# EAGLE design pressure_temp (EAGLE 9.6.2)
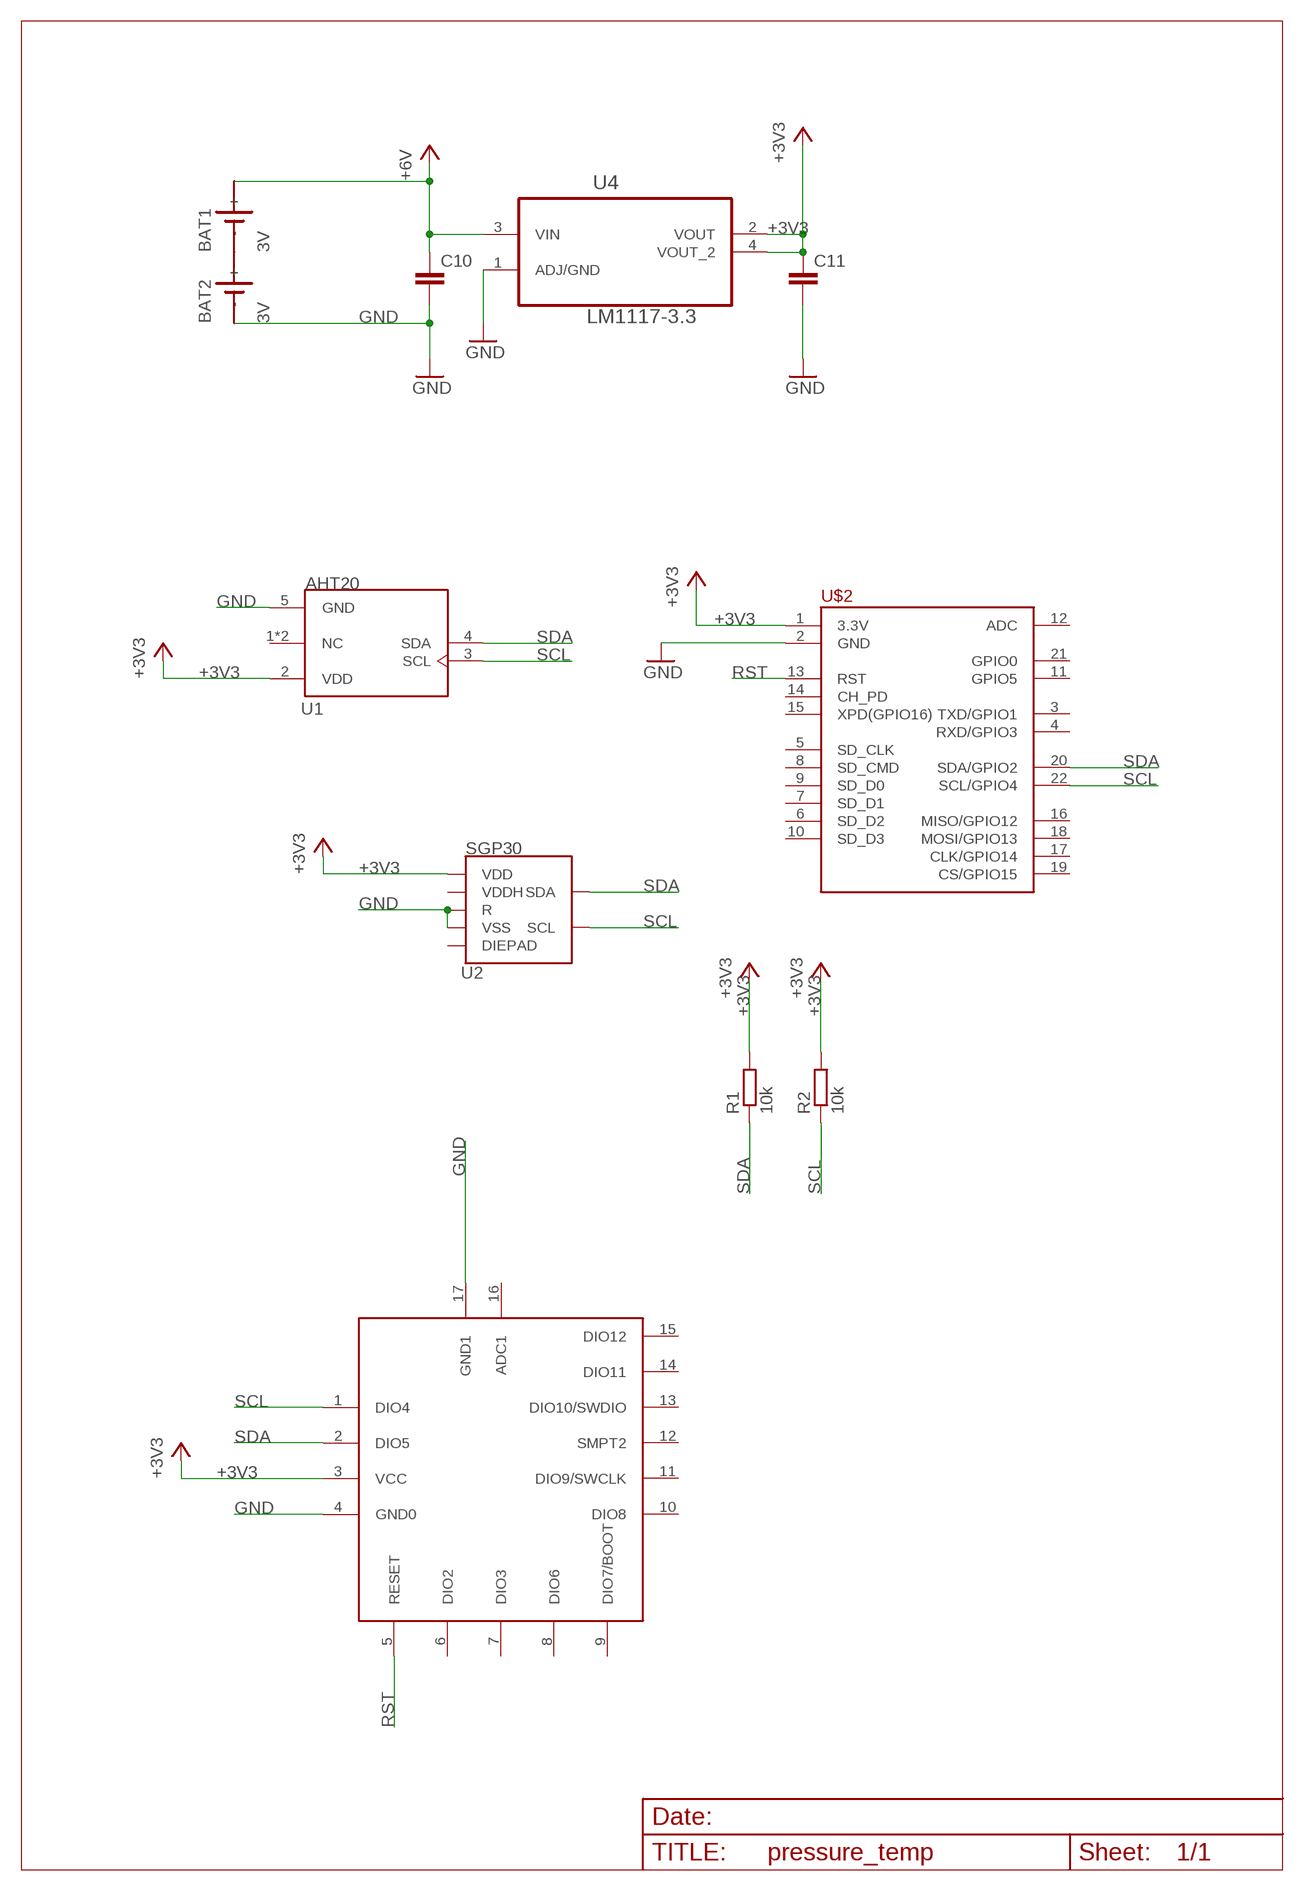
[diagram p0: schematic, sheet 1]

## Parts
BAT1  3V  SN2032  [SN2032]
BAT2  3V  SN2032  [SN2032]
C10  47u  C-EUC1206  [C1206]
C11  10u  C-EUC1206  [C1206]
R1  10k  R-EU_R0402  [R0402]
R2  10k  R-EU_R0402  [R0402]
U1  AHT20  [PSON100P300X300X110-6N]
U2  SGP30  [SGP30]
U4  LM1117-3.3  [SOT230]
U$1  BLUENRG-234BLEMODULE  [BLUENRG-234BLEMODULE]
U$2  OLIMEX_MOD-WIFI-ESP8266-DEV>PINS-OUTSIDE  [OLIMEX_MOD-WIFI-ESP8266-DEV-PINS-OUTSIDE]

## Nets
+3V3 [supply]: C11.1 R1.2 R2.2 U1.2(VDD) U2.1(VDD) U4.2(VOUT) U4.4(VOUT_2) U$1.3(VCC) U$2.1(3.3V)
+6V [supply]: BAT1.+ C10.1 U4.3(VIN)
GND: BAT2.- C10.2 C11.2 U1.5(GND) U2.2(VSS) U2.4(R) U4.1(ADJ/GND) U$1.4(GND0) U$1.17(GND1) U$2.2(GND)
N$1: BAT1.- BAT2.+
RST: U$1.5(RESET) U$2.13(RST)
SCL: R2.1 U1.3(SCL) U2.6(SCL) U$1.1(DIO4) U$2.22(SCL/GPIO4)
SDA: R1.1 U1.4(SDA) U2.3(SDA) U$1.2(DIO5) U$2.20(SDA/GPIO2)
Unconnected: U1.1(NC) U1.6(NC) U2.5(VDDH) U2.DIEPAD U$1.6(DIO2) U$1.7(DIO3) U$1.8(DIO6) U$1.9(DIO7/BOOT) U$1.10(DIO8) U$1.11(DIO9/SWCLK) U$1.12(SMPT2) U$1.13(DIO10/SWDIO) U$1.14(DIO11) U$1.15(DIO12) U$1.16(ADC1) U$2.3(TXD/GPIO1) U$2.4(RXD/GPIO3) U$2.5(SD_CLK) U$2.6(SD_D2) U$2.7(SD_D1) U$2.8(SD_CMD) U$2.9(SD_D0) U$2.10(SD_D3) U$2.11(GPIO5) U$2.12(ADC) U$2.14(CH_PD) U$2.15(XPD(GPIO16)) U$2.16(MISO/GPIO12) U$2.17(CLK/GPIO14) U$2.18(MOSI/GPIO13) U$2.19(CS/GPIO15) U$2.21(GPIO0)

## Library data of the parts
BAT1 BAT2 = sn2032:SN2032: LI BATTERY
C10 C11 = rcl:C-EU: CAPACITOR, European symbol; SPICEPREFIX: C
R1 R2 = rcl:R-EU_: RESISTOR, European symbol; SPICEPREFIX: R
U1 = AHT20:AHT20: Temperature and Humidity sensor Check availability <https://pricing.snapeda.com/parts/AHT20/Asair/view-part?ref=eda>; AVAILABILITY: Not in stock; DESCRIPTION: Temperature and Humidity sensor; MF: Asair; MP: AHT20; PACKAGE: Package; PRICE: None
U2 = SGP30:SGP30: The SGP30 is a digital multi-pixel gas sensor designed for easy integration into air purifier, demand-controlled ventilation, and IoT applications. Check availability <https://pricing.snapeda.com/parts/SGP30/Sensirion%20AG/view-part?ref=eda>; AVAILABILITY: In Stock; DESCRIPTION: SGP30, SHTC1 Air Quality, Humidity, Temperature Sensor Arduino Platform Evaluation Expansion Board; MF: Sensirion AG; MP: SGP30; PACKAGE: None; PRICE: None
U4 = LM1117-3.3:LM1117-3.3: IC REG LDO 800MA 3.3V Check prices <https://pricing.snapeda.com/parts/LM1117-3.3/Texas%20Instruments/view-part?ref=eda>; AVAILABILITY: In Stock; DESCRIPTION: Linear Voltage Regulator IC Positive Fixed 1 Output 800mA DDPAK/TO-263-3; MF: Texas Instruments; MP: LM1117-3.3; PACKAGE: None; PRICE: None
U$1 = BLUENRG-234blemodule:BLUENRG-234BLEMODULE: BLUENRG-234 BLE Module
U$2 = esp8266modules:OLIMEX_MOD-WIFI-ESP8266-DEV: Olimex MOD-WIFI-ESP8266-DEV is an development board for ESP8266 with all GPIOs and resources exposed. It can be soldered to PCB or used with breadboard. Small U.FL connector is provided for external antenna connection.

## Net classes
0 default: width 0.254 mm, clearance 0.203 mm
1 supply: width 0.406 mm, clearance 0.203 mm

## Board
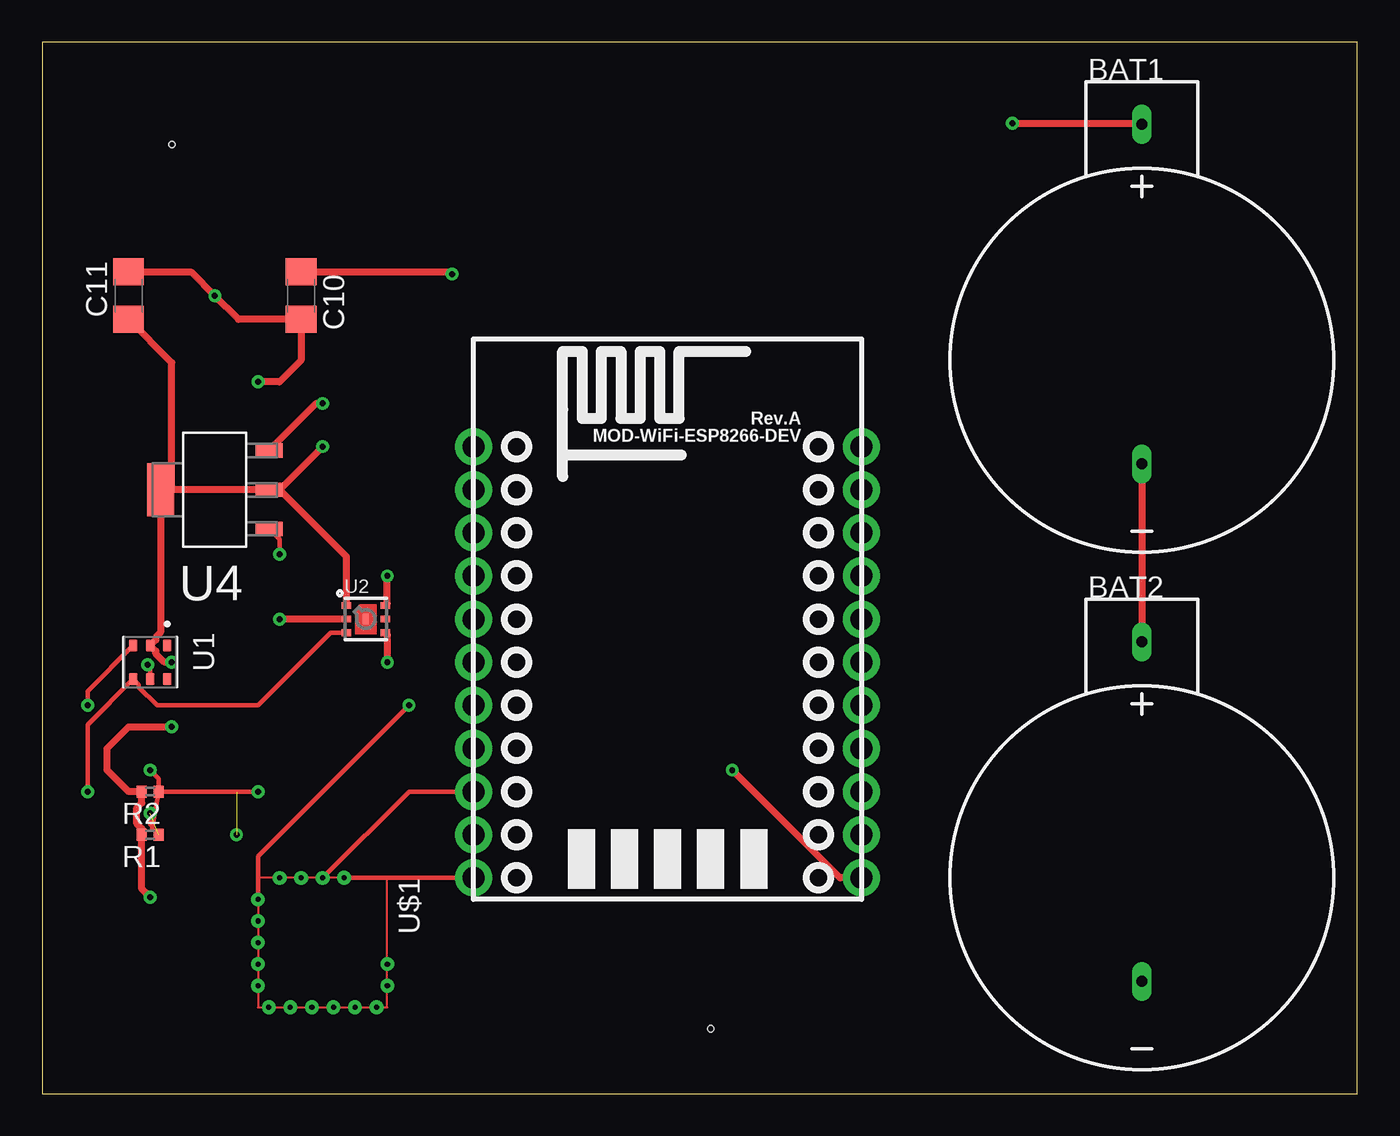
[diagram p1: board, top side]
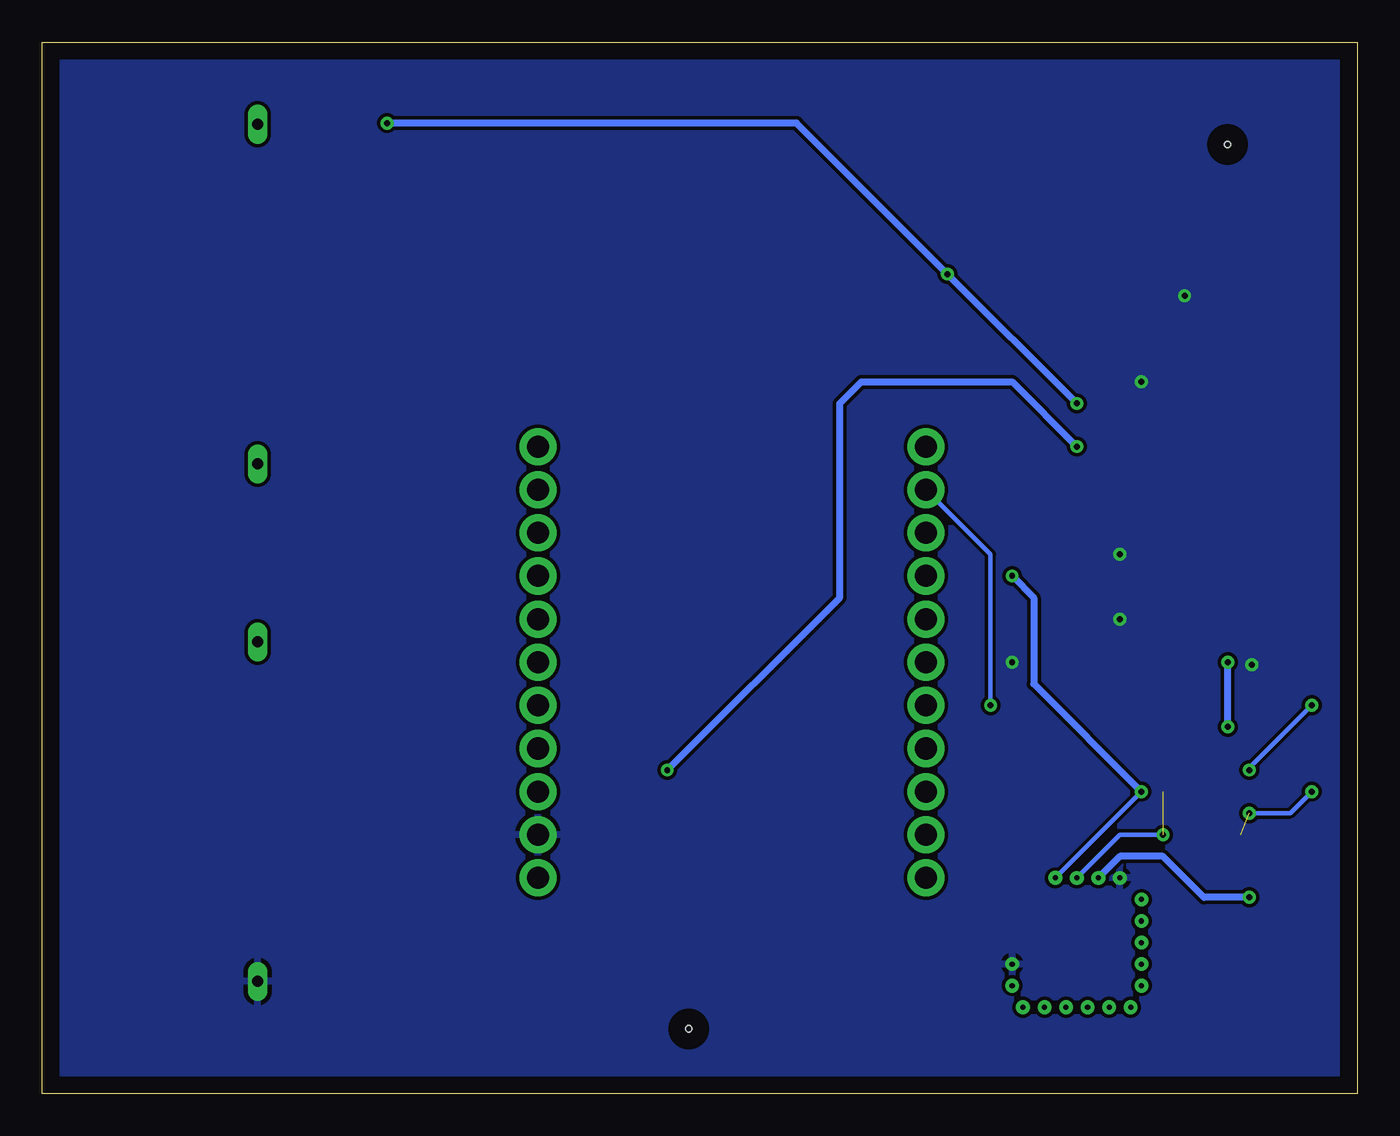
[diagram p2: board, bottom side, seen from below]

Size 77.45 x 61.9 mm. Coordinates in mm from the lower left corner, seen from the top.
Outline: 0,0 77.45,0 77.45,61.9 0,61.9 0,0
Copper layers (1*16): Top 0.035mm / dielectric 1.5mm / Bottom 0.035mm
Design rules "default": minimum track width 6mil, minimum drill 0.35mm, track to track 6mil, track to pad 6mil, pad to pad 6mil, via to via 6mil, smd to smd 6mil, copper to edge 40mil, drill to drill 6mil, minimum pad ring 10mil, minimum via ring 8mil, stop-mask expansion 4mil, vias tented up to drill 0mil, thermal gap 10mil
Holes 0.35 mm at 39.37,3.81 7.62,55.88

### Footprints (pad centres in the part's own frame; a part is rotated, then mirrored left to right if it is on the bottom)
SN2032 = drill 0.65 long: + 0,13.9; - 0,-6.1
C1206 = smd 1.6 x 1.8: 1 -1.4,0; 2 1.4,0
R0402 = smd 0.6 x 0.7: 1 -0.5,0; 2 0.5,0
PSON100P300X300X110-6N = smd 0.71 x 0.53: 1 -0.985,1; 2 -0.985,0; 3 -0.985,-1; 4 0.985,-1; 5 0.985,0; 6 0.985,1
SGP30 = smd 0.55 x 0.4: 1 -1.15,0.8; 2 -1.15,0; 3 -1.15,-0.8; 4 1.15,-0.8; 5 1.15,0; 6 1.15,0.8 | smd 0.305 x 0.61: DIEPAD 0,0
SOT230 = smd 1.6 x 0.838: 1 -3.2,2.311; 2 -3.2,0; 3 -3.2,-2.311 | smd 1.6 x 3.099: 4 3.2,0
BLUENRG-234BLEMODULE = drill 0.3 pad 0.813: 1 -3.81,1.27 | drill 0.3: 2 -3.81,0; 3 -3.81,-1.27; 4 -3.81,-2.54; 5 -2.54,-3.81; 6 -1.27,-3.81; 7 0,-3.81; 8 1.27,-3.81; 9 2.54,-3.81; 10 3.81,-3.175; 11 3.81,-1.905; 12 3.81,-0.635; 13 3.81,0.635; 14 3.81,1.905; 15 3.81,3.175; 16 2.54,3.81; 17 1.27,3.81
OLIMEX_MOD-WIFI-ESP8266-DEV-PINS-OUTSIDE = drill 1.3 pad 2.184: 1 0,0; 2 0,-2.54; 3 0,-5.08; 4 0,-7.62; 5 0,-10.16; 6 0,-12.7; 7 0,-15.24; 8 0,-17.78; 9 0,-20.32; 10 0,-22.86; 11 0,-25.4; 12 22.86,-25.4; 13 22.86,-22.86; 14 22.86,-20.32; 15 22.86,-17.78; 16 22.86,-15.24; 17 22.86,-12.7; 18 22.86,-10.16; 19 22.86,-7.62; 20 22.86,-5.08; 21 22.86,-2.54; 22 22.86,0

### Placement (x,y rotation side)
BAT1  64.77,43.18 0 top
BAT2  64.77,12.7 0 top
C10  15.24,46.99 270 top
C11  5.08,46.99 90 top
R1  6.35,15.24 180 top
R2  6.35,17.78 180 top
U1  6.35,25.4 270 top
U2  19.05,27.94 0 top
U4  10.16,35.56 180 top
U$1  16.51,8.89 270 top
U$2  48.26,12.7 180 top

### Tracks (layer width: path | path; a pad name or v marks a point on that pad's centre or on a via)
+3V3  (via drill 0.35)
  Top 0.406: 7.62,35.56 7.62,43.05 C11.1 | 7.62,35.56 U4.2 13.97,35.56 | U$2.1 46.99,12.7 v40.64,19.05 | U2.1 17.9,31.63 13.97,35.56 | v6.35,11.55 5.85,12.05 R1.2 5.85,15.6 5.57,15.89 5.57,16.84 5.85,17.12 R2.2 5.08,17.78 3.81,19.05 3.81,20.32 5.08,21.59 v7.62,21.59 | v7.62,25.4 7.18,25.4 6.68,25.9 6.68,26.06 U1.2 6.68,26.71 6.68,26.87 6.96,27.15 U4.4 7.62,35.56 | v16.51,38.1 13.97,35.56
  Bottom 0.406: v40.64,19.05 30.48,29.21 30.48,40.64 29.21,41.91 20.32,41.91 v16.51,38.1 | v6.35,11.55 9.01,11.55 11.43,13.97 13.97,13.97 U$1.3 | v7.62,21.59 v7.62,25.4
+6V  (via drill 0.35)
  Top 0.406: U4.3 16.13,40.64 v16.51,40.64 | v57.15,57.15 64.7,57.15 BAT1.+ | C10.1 24,48.39 v24.13,48.26
  Bottom 0.406: v16.51,40.64 v24.13,48.26 33.02,57.15 v57.15,57.15
GND  (via drill 0.35)
  Top 0.254: U1.5 6.35,25.12 v6.21,25.26 | U4.1 13.97,32.64 v13.97,31.75
  Top 0.406: U2.2 v13.97,27.94 | C11.2 8.76,48.39 v10.16,46.99 11.56,45.59 C10.2 15.24,43.18 13.97,41.91 v12.7,41.91 | U2.4 20.32,27.02 v20.32,25.4
  pour Bottom: -7.62,64.77 -7.62,-6.35 78.74,-6.35 80.01,-5.08 85.09,0 85.09,66.04
N$1
  Top 0.406: BAT1.- BAT2.+
RST  (via drill 0.35)
  Top 0.254: U$1.5 12.7,13.97 v21.59,22.86
  Bottom 0.254: v21.59,22.86 21.59,31.75 U$2.13
SCL  (via drill 0.35)
  Top 0.254: v12.7,17.78 R2.1 6.85,18.55 v6.35,19.05 | U1.3 2.66,23.7 v2.66,22.86 | U$1.1 U$2.22
  Top 0.406: U2.6 20.32,28.86 v20.32,30.48
  Bottom 0.254: v2.66,22.86 6.35,19.17 v6.35,19.05 | U$1.1 v12.7,17.78
  Bottom 0.406: v20.32,30.48 19.05,29.21 19.05,24.13 v12.7,17.78
SDA  (via drill 0.35)  (2 unrouted)
  Top 0.254: 11.43,17.78 6.85,17.78 6.48,15.61 6.48,15.73 6.35,15.86 v6.35,16.51 | v2.66,17.78 2.66,21.73 U1.4 5.68,24.09 5.68,23.93 6.75,22.86 12.7,22.86 16.98,27.14 U2.3 | U$1.2 21.59,17.78 U$2.20
  Bottom 0.254: v6.35,16.51 3.93,16.51 v2.66,17.78 | v11.43,15.24 13.97,15.24 U$1.2